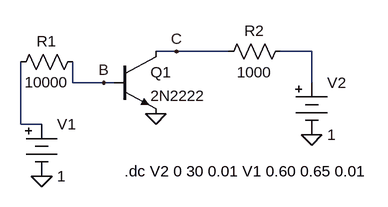
[diagram p0: schematic Transistor.asc]
Transistor.asc, the LTspice schematic file:
Version 4
SHEET 1 880 680
WIRE 176 80 144 80
WIRE 256 80 176 80
WIRE 384 80 336 80
WIRE 16 128 16 96
WIRE 64 128 16 128
WIRE 80 128 64 128
WIRE 384 128 384 80
WIRE -64 192 -64 96
WIRE -32 192 -64 192
FLAG 144 176 0
FLAG 384 208 0
FLAG -32 272 0
FLAG 176 80 C
FLAG 64 128 B
SYMBOL npn 80 80 R0
SYMATTR InstName Q1
SYMATTR Value 2N2222
SYMBOL Misc\\battery -32 176 R0
SYMATTR InstName V1
SYMATTR Value 1
SYMBOL Misc\\battery 384 112 R0
SYMATTR InstName V2
SYMATTR Value 1
SYMBOL res 32 80 R90
WINDOW 0 0 56 VBottom 2
WINDOW 3 32 56 VTop 2
SYMATTR InstName R1
SYMATTR Value 10000
SYMBOL res 352 64 R90
WINDOW 0 0 56 VBottom 2
WINDOW 3 32 56 VTop 2
SYMATTR InstName R2
SYMATTR Value 1000
TEXT 96 264 Left 2 !.dc V2 0 30 0.01 V1 0.60 0.65 0.01

The netlist it stands for:
* Transistor.asc
Q1 C B 0 0 2N2222
V1 N002 0 1
V2 N001 0 1
R1 B N002 10000
R2 N001 C 1000
.model NPN NPN
.model PNP PNP
.lib standard.bjt
.dc V2 0 30 0.01 V1 0.60 0.65 0.01
.backanno
.end